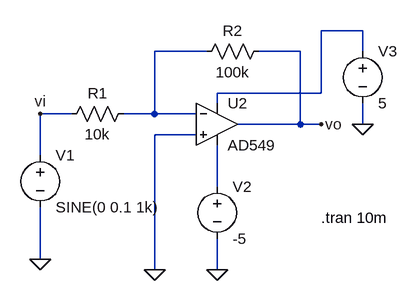
[diagram p0: schematic 12kadai1.asc]
12kadai1.asc, the LTspice schematic file:
Version 4
SHEET 1 880 680
WIRE 624 176 560 176
WIRE 384 208 304 208
WIRE 528 208 464 208
WIRE 624 208 624 176
WIRE 560 272 560 176
WIRE 560 272 400 272
WIRE 400 288 400 272
WIRE 176 304 128 304
WIRE 304 304 304 208
WIRE 304 304 256 304
WIRE 368 304 304 304
WIRE 528 320 528 208
WIRE 528 320 432 320
WIRE 560 320 528 320
WIRE 624 320 624 288
WIRE 368 336 304 336
WIRE 128 368 128 304
WIRE 400 416 400 352
WIRE 128 528 128 448
WIRE 304 544 304 336
WIRE 400 544 400 496
FLAG 128 528 0
FLAG 400 544 0
FLAG 624 320 0
FLAG 304 544 0
FLAG 128 304 vi
FLAG 560 320 vo
SYMBOL voltage 128 352 R0
SYMATTR InstName V1
SYMATTR Value SINE(0 0.1 1k)
SYMBOL voltage 400 400 R0
SYMATTR InstName V2
SYMATTR Value -5
SYMBOL voltage 624 192 R0
SYMATTR InstName V3
SYMATTR Value 5
SYMBOL res 272 288 R90
WINDOW 0 0 56 VBottom 2
WINDOW 3 32 56 VTop 2
SYMATTR InstName R1
SYMATTR Value 10k
SYMBOL res 480 192 R90
WINDOW 0 0 56 VBottom 2
WINDOW 3 32 56 VTop 2
SYMATTR InstName R2
SYMATTR Value 100k
SYMBOL AD549 400 256 R0
SYMATTR InstName U2
TEXT 560 464 Left 2 !.tran 10m

The netlist it stands for:
* 12kadai1.asc
V1 vi 0 SINE(0 0.1 1k)
V2 N003 0 -5
V3 N001 0 5
R1 N002 vi 10k
R2 vo N002 100k
XU2 0 N002 N001 N003 vo AD549  ; pins In+ In- V+ V- OUT
.tran 10m
.backanno
.end